# Altium schematic sheet ground_station.SchDoc
size 254 x 203 mm; DrawnBy: Şeyda Nur Kas
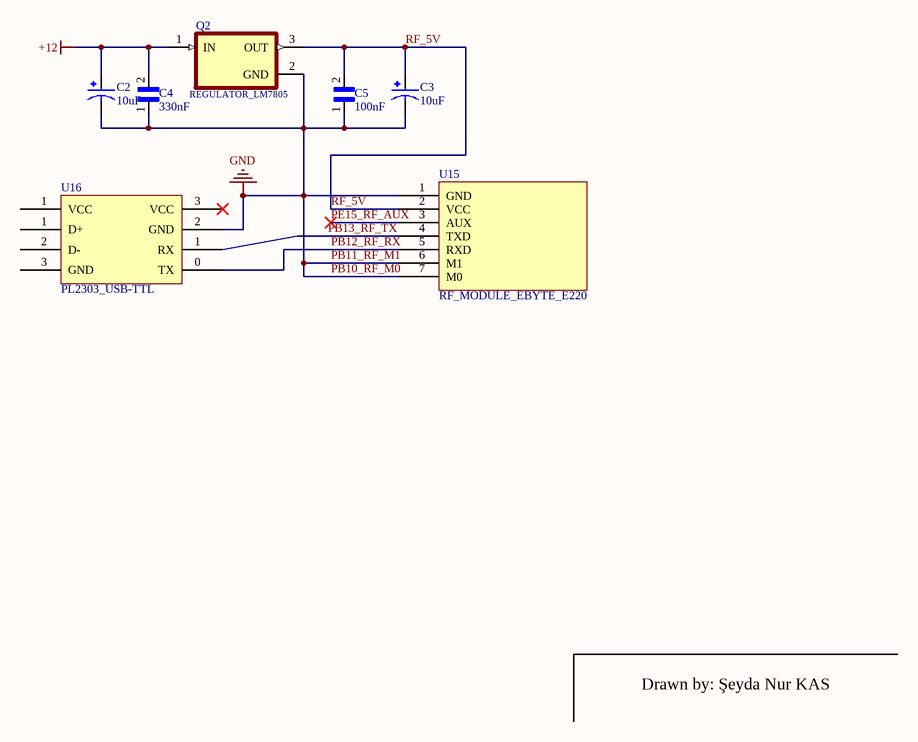
[diagram p0: ground_station.SchDoc]

## Parts
C2  10uF  [CAPPRD200W50D500H1500]
C3  10uF  [CAPPRD200W50D500H1500]
C4  330nF  [CAPC1608X90N]
C5  100nF  [CAPC3216X180N]
Q2  REGULATOR_LM7805  [TO254P1054X470X2600-3]
U15  RF_MODULE_EBYTE_E220
U16  PL2303_USB-TTL

## Nets
+12: C2.P C4.2 Q2.1(IN)
PB10_RF_M0: C2.N C3.N C4.1 C5.1 Q2.2(GND) U15.1(GND) U15.6(M1) U15.7(M0) U16.2(D-)  [also labelled GND, PB11_RF_M1]
PB12_RF_RX: U15.5(RXD) U16.0(TX)
PB13_RF_TX: U15.4(TXD) U16.1(VCC)
PE15_RF_AUX: U15.3(AUX)
RF_5V: C3.P C5.2 Q2.3(OUT) U15.2(VCC)

Not connected (* = marked no-connect by the designer): U16 3(GND)

## Notes on the sheet
- Drawn by: Şeyda Nur KAS
- Title
- Size:
- Date:
- A4
- Number:
- Time:
- Revision:
- Sheet
- of
- File:

## Library data of the parts
C2 C3 = EEUEB1J100: CAP ALUM 10UF 20% 63V RADIAL; MF: Panasonic; Value: *; SnapEDA_Link: https://www.snapeda.com/parts/EEUEB1J100/Panasonic/view-part/?ref=snap; MP: EEUEB1J100; Purchase-URL: https://pricing.snapeda.com/search/part/EEUEB1J100/?ref=eda; Check_prices: https://www.snapeda.com/parts/EEUEB1J100/Panasonic/view-part/?ref=eda; Availability: In Stock; Price: None; Package: RADIAL-2 Panasonic
C4 = 06035A160JAT2A: CERAMIC CAPACITOR 16PF 50V, C0G, 5%, 060; Package: None; Price: None; Value: *; MP: 06035A160JAT2A; Availability: Unavailable
C5 = CL31B104KBCNNNC: Ceramic capacitor SMD 1206 100 nF 50 V 10 % Samsung Electro-Mechanics CL31B104KBCNNNC 4000 pc(s); MP: CL31B104KBCNNNC; SnapEDA_Link: https://www.snapeda.com/parts/CL31B104KBCNNNC/Samsung+Electro-Mechanics/view-part/?ref=snap; Availability: In Stock; MF: Samsung Electro-Mechanics; Package: 1206 Samsung; Check_prices: https://www.snapeda.com/parts/CL31B104KBCNNNC/Samsung+Electro-Mechanics/view-part/?ref=eda; Value: *; Purchase-URL: https://pricing.snapeda.com/search/part/CL31B104KBCNNNC/?ref=eda; Price: None
Q2 = LM7805CT/NOPB: Linear Voltage Regulator IC Positive Fixed 1 Output 1.5A TO-220-3; MF: ON Semiconductor; Purchase-URL: https://pricing.snapeda.com/search/part/LM7805CT/?ref=eda; Check_prices: https://www.snapeda.com/parts/LM7805CT/Onsemi/view-part/?ref=eda; SnapEDA_Link: https://www.snapeda.com/parts/LM7805CT/Onsemi/view-part/?ref=snap; Price: None; Availability: In Stock; Package: TO-220-3 ON Semiconductor; MP: LM7805CT; Value: *
U15 U16 = Component_1